# EAGLE schematic Arduino Nano+ch340g (EAGLE 6.5.0)
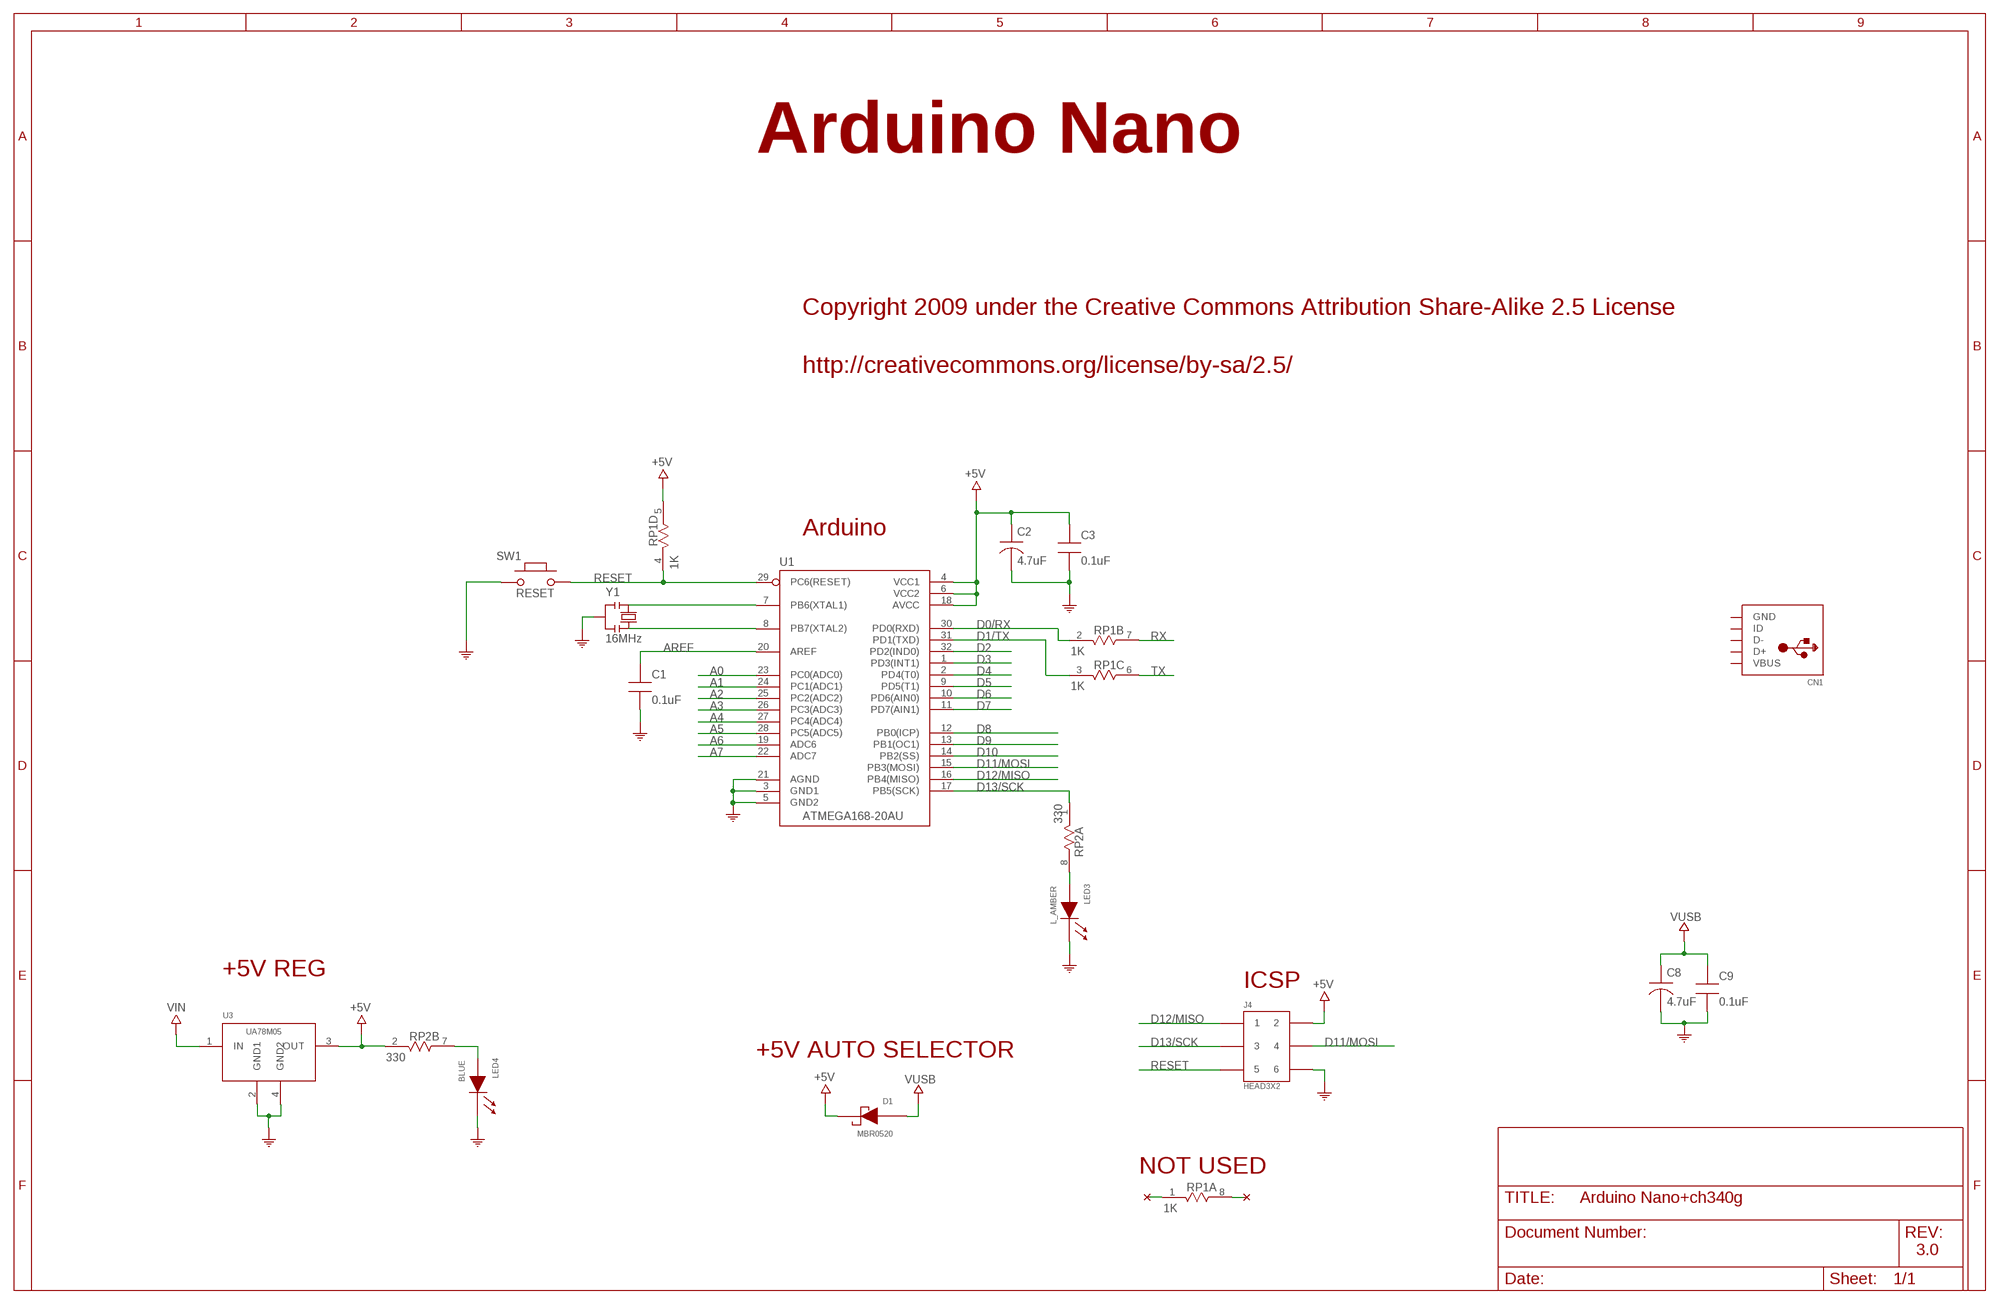
[diagram p0: schematic, sheet 1]

## Parts
C1  0.1uF  CAP0805-NP  [CAP0805-NP]
C2  4.7uF  CAP-TANA-P  [TAN-A]
C3  0.1uF  CAP0805-NP  [CAP0805-NP]
C8  4.7uF  CAP-TANA-P  [TAN-A]
C9  0.1uF  CAP0805-NP  [CAP0805-NP]
CN1  USBMOLEX  [USB-MINIB-THM-MOLEX]
D1  MBR0520  [SOD-123]
J4  HEAD3X2  [HEAD3X2]
LED3  L_AMBER  LED0805  [LED0805]
LED4  BLUE  LED0805  [LED0805]
RP1  1K  RES4NT  [RES4NT]
RP2  330  RES4NT  [RES4NT]
SW1  RESET  PB157  [157SW]
U1  ATMEGA168-20AU  [QFP032]
U3  UA78M05  [SOT223]
Y1  16MHz  RESONATORMU  [RESONATOR]

## Nets
+5V: C2.1 C3.1 D1.1(CA) J4.2 RP1.5 RP2.2 U1.4(VCC1) U1.6(VCC2) U1.18(AVCC) U3.3(OUT)
A0: U1.23(PC0(ADC0))
A1: U1.24(PC1(ADC1))
A2: U1.25(PC2(ADC2))
A3: U1.26(PC3(ADC3))
A4: U1.27(PC4(ADC4))
A5: U1.28(PC5(ADC5))
A6: U1.19(ADC6)
A7: U1.22(ADC7)
AREF: C1.1 U1.20(AREF)
COM: C1.2 C2.2 C3.2 C8.2 C9.2 J4.6 LED3.1(CA) LED4.1(CA) SW1.1 U1.3(GND1) U1.5(GND2) U1.21(AGND) U3.2(GND1) U3.4(GND2) Y1.2
D0/RX: RP1.2 U1.30(PD0(RXD))
D1/TX: RP1.3 U1.31(PD1(TXD))
D2: U1.32(PD2(IND0))
D3: U1.1(PD3(INT1))
D4: U1.2(PD4(T0))
D5: U1.9(PD5(T1))
D6: U1.10(PD6(AIN0))
D7: U1.11(PD7(AIN1))
D8: U1.12(PB0(ICP))
D9: U1.13(PB1(OC1))
D10: U1.14(PB2(SS))
D11/MOSI: J4.4 U1.15(PB3(MOSI))
D12/MISO: J4.1 U1.16(PB4(MISO))
D13/SCK: J4.3 RP2.1 U1.17(PB5(SCK))
N$1: U1.8(PB7(XTAL2)) Y1.3
N$2: U1.7(PB6(XTAL1)) Y1.1
N$3: LED4.2(AN) RP2.7
N$7: LED3.2(AN) RP2.8
N$24: RP1.1
N$25: RP1.8
RESET: J4.5 RP1.4 SW1.2 U1.29(PC6(RESET))
RX: RP1.7
TX: RP1.6
VIN: U3.1(IN)
VUSB: C8.1 C9.1 D1.2(AN)
Unconnected: CN1.D+ CN1.D- CN1.ID RP2.3 RP2.4 RP2.5 RP2.6

## Notes on the sheet
- Arduino Nano
- Copyright 2009 under the Creative Commons Attribution Share-Alike 2.5 License
- http://creativecommons.org/license/by-sa/2.5/
- Arduino
- +5V REG
- ICSP
- +5V AUTO SELECTOR
- NOT USED
- 3.0

## Power pins joined to a net without a drawn wire
GND: CN1.GND
VBUS: CN1.VBUS

## Library data of the parts
C1 C3 C9 = MySMD:CAP0805-NP
C2 C8 = MySMD:CAP-TANA-P
CN1 = adafruit:USB: USB Connectors USBMINIB - Surface Mount Female Mini-B USB Connector 4UConnector: 06564 By microbuilder.eu Thru-hole RA Female Mini-B USB Connector 4UConnector: 18732 By ladyada.net
D1 = MySMD:MBR0520
J4 = MyCON2:HEAD3X2
LED3 LED4 = MySMD:LED0805
RP1 RP2 = MySMD:RES4NT
SW1 = MySMD:PB157
U1 = MySMD:ATMEGA168-20AU
U3 = MySMD:UA78M05
Y1 = MySMD2:RESONATOR